# EAGLE design placa_motor_v5 (EAGLE 9.6.2)
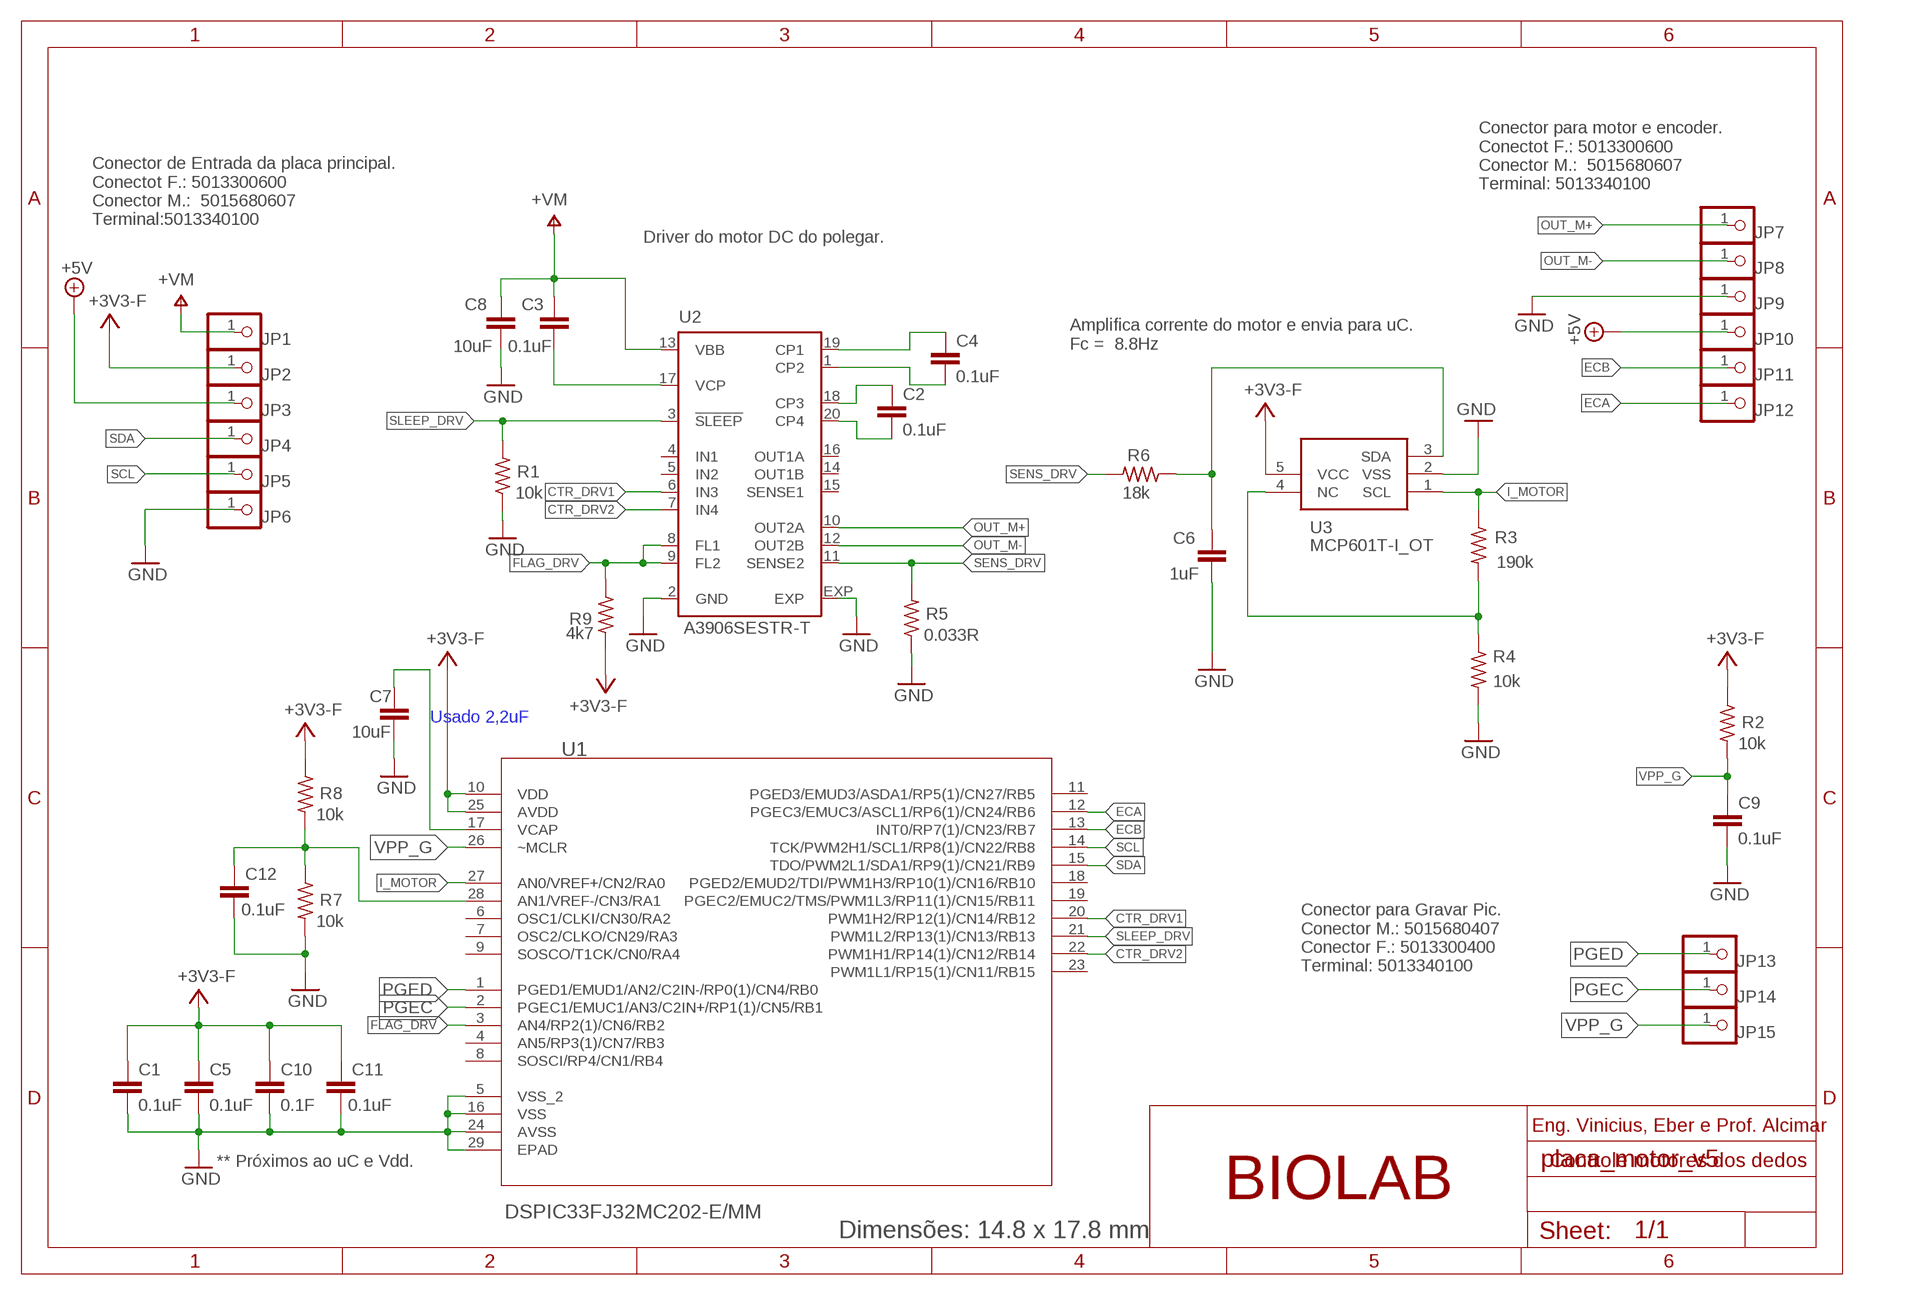
[diagram p0: schematic, sheet 1]

## Parts
C1  0.1uF  C-EUC0402K  [C0402K]
C2  0.1uF  C-EUC0402K  [C0402K]
C3  0.1uF  C-EUC0402K  [C0402K]
C4  0.1uF  C-EUC0402K  [C0402K]
C5  0.1uF  C-EUC0402K  [C0402K]
C6  1uF  C-EUC0402K  [C0402K]
C7  10uF  C-EUC0805K  [C0805K]
C8  10uF  C-EUC0805K  [C0805K]
C9  0.1uF  C-EUC0402K  [C0402K]
C10  0.1F  C-EUC0402K  [C0402K]
C11  0.1uF  C-EUC0402K  [C0402K]
C12  0.1uF  C-EUC0402K  [C0402K]
JP1  PINHD-1X1  [1X01]
JP2  PINHD-1X1  [1X01]
JP3  PINHD-1X1  [1X01]
JP4  PINHD-1X1  [1X01]
JP5  PINHD-1X1  [1X01]
JP6  PINHD-1X1  [1X01]
JP7  PINHD-1X1  [1X01]
JP8  PINHD-1X1  [1X01]
JP9  PINHD-1X1  [1X01]
JP10  PINHD-1X1  [1X01]
JP11  PINHD-1X1  [1X01]
JP12  PINHD-1X1  [1X01]
JP13  PINHD-1X1  [1X01]
JP14  PINHD-1X1  [1X01]
JP15  PINHD-1X1  [1X01]
R1  10k  R-US_R0402  [R0402]
R2  10k  R-US_R0402  [R0402]
R3  190k  R-US_R0402  [R0402]
R4  10k  R-US_R0402  [R0402]
R5  0.033R  R-US_R0805  [R0805]
R6  18k  R-US_R0402  [R0402]
R7  10k  R-US_R0402  [R0402]
R8  10k  R-US_R0402  [R0402]
R9  4k7  R-US_R0402  [R0402]
U1  DSPIC33FJ32MC202-E/MM  [QFN65P600X600X100-29N]
U2  A3906SESTR-T  A3906  [QFN20]
U3  MCP601T-I_OT  [SOT95P270X145-5N]

## Nets
+3V3: C1.1 C5.1 C10.1 C11.1 JP2.1 R2.1 R8.1 R9.2 U1.10(VDD) U1.25(AVDD) U3.5(VCC) ; supply symbol labelled +3V3-F
+5V: JP3.1 JP10.1
AUX: C12.1 R7.1 R8.2 U1.28(AN1/VREF-/CN3/RA1)
CTR_DRV1: U1.20(PWM1H2/RP12(1)/CN14/RB12) U2.6(IN3)
CTR_DRV2: U1.22(PWM1H1/RP14(1)/CN12/RB14) U2.7(IN4)
ECA: JP12.1 U1.12(PGEC3/EMUC3/ASCL1/RP6(1)/CN24/RB6)
ECB: JP11.1 U1.13(INT0/RP7(1)/CN23/RB7)
FLAG_DRV: R9.1 U1.3(AN4/RP2(1)/CN6/RB2) U2.8(FL1) U2.9(FL2)
GND: C1.2 C5.2 C6.2 C7.2 C8.1 C9.2 C10.2 C11.2 C12.2 JP6.1 JP9.1 R1.1 R4.2 R5.1 R7.2 U1.5(VSS_2) U1.16(VSS) U1.24(AVSS) U1.29(EPAD) U2.2(GND) U2.EXP U3.2(VSS)
I_MOTOR: R3.1 U1.27(AN0/VREF+/CN2/RA0) U3.1(SCL)
N1: C7.1 U1.17(VCAP)
N2: R3.2 R4.1 U3.4(NC)
N3: C6.1 R6.1 U3.3(SDA)
N4: C4.1 U2.19(CP1)
N5: C4.2 U2.1(CP2)
N6: C2.1 U2.18(CP3)
N7: C2.2 U2.20(CP4)
N8: C3.2 U2.17(VCP)
OUT_M+: JP7.1 U2.10(OUT2A)
OUT_M-: JP8.1 U2.12(OUT2B)
PGEC: JP14.1 U1.2(PGEC1/EMUC1/AN3/C2IN+/RP1(1)/CN5/RB1)
PGED: JP13.1 U1.1(PGED1/EMUD1/AN2/C2IN-/RP0(1)/CN4/RB0)
SCL: JP5.1 U1.14(TCK/PWM2H1/SCL1/RP8(1)/CN22/RB8)
SDA: JP4.1 U1.15(TDO/PWM2L1/SDA1/RP9(1)/CN21/RB9)
SENS_DRV: R5.2 R6.2 U2.11(SENSE2)
SLEEP_DRV: R1.2 U1.21(PWM1L2/RP13(1)/CN13/RB13) U2.3(!SLEEP)
V+: C3.1 C8.2 JP1.1 U2.13(VBB) ; supply symbol labelled +VM
VPP_G: C9.1 JP15.1 R2.2 U1.26(~MCLR)
Unconnected: U1.4(AN5/RP3(1)/CN7/RB3) U1.6(OSC1/CLKI/CN30/RA2) U1.7(OSC2/CLKO/CN29/RA3) U1.8(SOSCI/RP4/CN1/RB4) U1.9(SOSCO/T1CK/CN0/RA4) U1.11(PGED3/EMUD3/ASDA1/RP5(1)/CN27/RB5) U1.18(PGED2/EMUD2/TDI/PWM1H3/RP10(1)/CN16/RB10) U1.19(PGEC2/EMUC2/TMS/PWM1L3/RP11(1)/CN15/RB11) U1.23(PWM1L1/RP15(1)/CN11/RB15) U2.4(IN1) U2.5(IN2) U2.14(OUT1B) U2.15(SENSE1) U2.16(OUT1A)

## Notes on the sheet
- Conector para motor e encoder.
  Conectot F.: 5013300600
  Conector M.:  5015680607
  Terminal: 5013340100
- Conector de Entrada da placa principal.
  Conectot F.: 5013300600
  Conector M.:  5015680607
  Terminal:5013340100
- Driver do motor DC do polegar.
- Amplifica corrente do motor e envia para uC.
  Fc =  8.8Hz
- Usado 2,2uF
- Conector para Gravar Pic.
  Conector M.: 5015680407
  Conector F.: 5013300400
  Terminal: 5013340100
- Eng. Vinicius, Eber e Prof. Alcimar
- ** Próximos ao uC e Vdd. | Controle motores dos dedos
- BIOLAB
- Dimensões: 14.8 x 17.8 mm

## Library data of the parts
C1-C12 = rcl:C-EU: CAPACITOR, European symbol; SPICEPREFIX: C
JP1-JP15 = ABS_Lib:PINHD-1X1: PIN HEADER; CATEGORY: CONNECTOR; SUB-CATEGORY: PIN-HEADER
R1-R9 = rcl:R-US_: RESISTOR, American symbol; SPICEPREFIX: R
U1 = DSPIC33FJ32MC202-E_MM:DSPIC33FJ32MC202-E/MM: 16-bit Digital Signal Controllers; DESCRIPTION: dsPIC Automotive, AEC-Q100, dsPIC™ 33F Microcontroller IC 16-Bit 40 MIPs 32KB _32K x 8_ FLASH 28-QFN-S _6x6_; DIGI-KEY_PART_NUMBER: DSPIC33FJ32MC202-E/MM-ND; DIGI-KEY_PURCHASE_URL: https://www.digikey.com/product-detail/en/microchip-technology/DSPIC33FJ32MC202-E-MM/DSPIC33FJ32MC202-E-MM-ND/1635835?utm_source=snapeda&utm_medium=aggregator&utm_campaign=symbol; MF: Microchip; MP: DSPIC33FJ32MC202-E/MM; PACKAGE: QFN-28 Microchip
U2 = allegro:A3906: Low Voltage Stepper and Single/Dual DC Motor Driver Data Sheet <http://www.allegromicro.com/en/Products/Part_Numbers/3906/3906.pdf>; SPICEPREFIX: X
U3 = MCP601T-I_OT:MCP601T-I_OT: 2.7 to 5.5V CMOS Operational Amplifier Source: Datasheet <http://ww1.microchip.com/downloads/en/DeviceDoc/21178H.pdf>; DESCRIPTION: 2.7 to 5.5V CMOS Operational Amplifier; HEIGHT: 1.45mm; MANUFACTURER_NAME: Microchip; MANUFACTURER_PART_NUMBER: MCP601T-I/OT; MOUSER_PART_NUMBER: 579-MCP601T-I/OT; MOUSER_PRICE-STOCK: https://www.mouser.co.uk/ProductDetail/Microchip-Technology/MCP601T-I-OT?qs=TQnwojwsYvgI5ywjvKCAVw%3D%3D

## Net classes
0 default: width 0.09 mm, drill 0.254 mm, clearance 0.05 mm
1 Power: width 0.15 mm, drill 0.254 mm, clearance 0.05 mm to class 0, clearance 0.05 mm

## Board
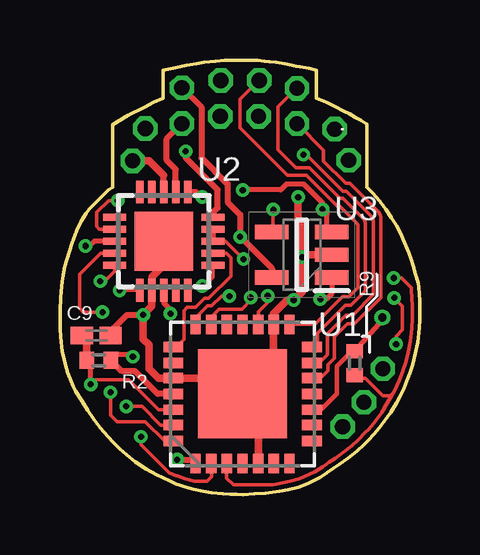
[diagram p1: board, top side]
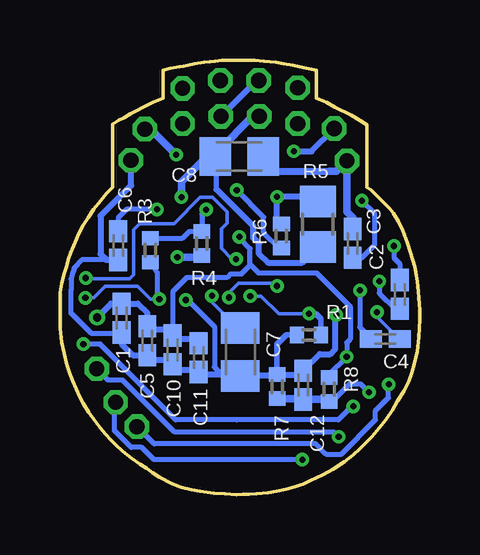
[diagram p2: board, bottom side, seen from below]

Size 15 x 18.11 mm. Coordinates in mm from the lower left corner, seen from the top.
Outline: 7.37,0 7.11,0.01 6.8,0.03 6.32,0.08 5.97,0.15 5.57,0.22 5.19,0.32 4.95,0.41 4.87,0.44 4.57,0.57 4.03,0.82 3.61,1.05 3.14,1.36 2.77,1.66 2.5,1.92 2.22,2.17 2,2.41 1.68,2.77 1.42,3.11 1.15,3.51 0.92,3.9 0.66,4.3 0.55,4.51 0.46,4.71 0.33,5.07 0.21,5.46 0.1,5.96 0.04,6.55 0.01,6.93 0,7.31 0,7.71 0.03,8.18 0.06,8.47 0.09,8.87 0.14,9.14 0.2,9.48 0.39,10.1 0.51,10.49 0.69,11 0.89,11.4 1.1,11.72 1.22,11.89 1.51,12.18 2.02,12.68 2.2,12.81 2.2,15.41 2.85,15.8 3.52,16.14 3.9,16.34 4.3,16.51 4.3,17.68 4.82,17.78 5.28,17.88 5.69,17.95 6,18.01 6.49,18.06 6.88,18.09 7.2,18.11 7.9,18.11 8.23,18.09 8.52,18.06 8.74,18.04 9,18.01 9.39,17.95 9.67,17.89 9.84,17.85 10.01,17.82 10.38,17.75 10.7,17.68 10.7,16.51 11.12,16.34 11.48,16.15 11.85,15.97 12.06,15.87 12.33,15.7 12.55,15.59 12.8,15.43 12.8,12.81 13.05,12.55 13.31,12.25 13.59,11.88 13.83,11.54 14.03,11.21 14.2,10.91 14.37,10.52 14.55,10.08 14.65,9.79 14.73,9.51 14.82,9.2 14.94,8.8 14.98,8.41 15,8.01 15,7.6 15,7.31 14.99,6.93 14.93,6.35 14.83,5.89 14.71,5.43 14.59,5.04 14.48,4.75 14.33,4.41 14.18,4.08 14.02,3.8 13.8,3.43 13.58,3.11 13.33,2.79 13.09,2.5 12.86,2.27 12.7,2.11 12.38,1.81 12.01,1.51 11.66,1.26 11.4,1.09 11.13,0.9 10.85,0.73 10.32,0.45 9.96,0.31 9.51,0.2 9.15,0.15 8.58,0.05 8.11,0.03 7.64,0 7.37,0
Copper layers (1*16): Top 0.035mm / dielectric 0.5mm / Bottom 0.035mm
Design rules "default *": minimum track width 6mil, minimum drill 6mil, track to track 6mil, track to pad 6mil, pad to pad 6mil, via to via 6mil, smd to smd 6mil, copper to edge 6mil, drill to drill 8mil, minimum pad ring 6mil, minimum via ring 6mil, stop-mask expansion 0mil, vias tented up to drill 0mil, thermal gap 10mil

### Footprints (pad centres in the part's own frame; a part is rotated, then mirrored left to right if it is on the bottom)
C0402K = smd 0.925 x 0.74: 1 -0.6,0; 2 0.6,0
C0805K = smd 1.3 x 1.6: 1 -1,0; 2 1,0
1X01 = drill 0.635 pad 1.016 octagon: 1 0,0
R0402 = smd 0.6 x 0.7: 1 -0.5,0; 2 0.5,0
R0805 = smd 1.3 x 1.5: 1 -0.95,0; 2 0.95,0
QFN65P600X600X100-29N = smd 0.813 x 0.432: 1 -2.896,1.956; 2 -2.896,1.295; 3 -2.896,0.66; 4 -2.896,0; 5 -2.896,-0.66; 6 -2.896,-1.295; 7 -2.896,-1.956; 15 2.896,-1.956; 16 2.896,-1.295; 17 2.896,-0.66; 18 2.896,0; 19 2.896,0.66; 20 2.896,1.295; 21 2.896,1.956 | smd 0.432 x 0.813: 8 -1.956,-2.896; 9 -1.295,-2.896; 10 -0.66,-2.896; 11 0,-2.896; 12 0.66,-2.896; 13 1.295,-2.896; 14 1.956,-2.896; 22 1.956,2.896; 23 1.295,2.896; 24 0.66,2.896; 25 0,2.896; 26 -0.66,2.896; 27 -1.295,2.896; 28 -1.956,2.896 | smd 3.708 x 3.708: 29 0,0
QFN20 = smd 0.95 x 0.3: 1 -2.05,1; 2 -2.05,0.5; 3 -2.05,0; 4 -2.05,-0.5; 5 -2.05,-1; 11 2.05,-1; 12 2.05,-0.5; 13 2.05,0; 14 2.05,0.5; 15 2.05,1 | smd 0.3 x 0.95: 6 -1,-2.05; 7 -0.5,-2.05; 8 0,-2.05; 9 0.5,-2.05; 10 1,-2.05; 16 1,2.05; 17 0.5,2.05; 18 0,2.05; 19 -0.5,2.05; 20 -1,2.05 | smd 2.45 x 2.45: EXP 0,0
SOT95P270X145-5N = smd 1.4 x 0.6: 1 -1.25,0.95; 2 -1.25,0; 3 -1.25,-0.95; 4 1.25,-0.95; 5 1.25,0.95

### Placement (x,y rotation side)
C1  12.43,7.35 270 bottom
C2  0.83,8.34 270 bottom
C3  2.79,10.47 270 bottom
C4  1.43,6.48 180 bottom
C5  11.36,6.41 270 bottom
C6  12.57,10.38 270 bottom
C7  7.47,5.94 270 bottom
C8  7.52,14.08 0 bottom
C9  1.52,6.63 0 top
C10  10.3,6.02 270 bottom
C11  9.22,5.71 270 bottom
C12  4.86,4.56 90 bottom
JP1  3.03,13.9 0 top
JP2  5.09,16.95 0 top
JP3  6.71,17.26 0 top
JP4  8.31,17.26 0 top
JP5  9.89,16.93 0 top
JP6  6.69,15.76 0 top
JP7  3.56,15.25 0 top
JP8  5.09,15.45 0 top
JP9  12.05,13.93 0 top
JP10  8.29,15.76 0 top
JP11  11.46,15.23 0 top
JP12  9.89,15.45 0 top
JP13  12.68,3.85 0 top
JP14  13.47,5.24 0 top
JP15  11.79,2.83 0 top
R1  4.62,6.65 0 bottom
R2  1.62,5.6 180 top
R3  11.23,10.18 90 bottom
R4  9.09,10.46 270 bottom
R5  4.24,11.26 90 bottom
R6  5.77,10.77 90 bottom
R7  5.94,4.49 90 bottom
R8  3.78,4.38 270 bottom
R9  12.29,5.47 90 top
U1  7.61,4.19 90 top
U2  4.33,10.56 90 top
U3  10.09,9.99 180 top

### Tracks (layer width: path | path; a pad name or v marks a point on that pad's centre or on a via)
+3V3  (via drill 0.25, 0.35)
  Top 0.178: U1.10 10.88,3.53 11.56,4.21 11.56,5.34 12.29,6.07 R9.2
  Top 0.203: 7.56,10.72 7.54,10.74 v7.52,10.74 | v13.45,7.37 13.45,7.28 R9.2 | JP2.1 | v3.04,5.74 2.97,5.82 2.33,5.82 R2.1
  Top 0.254: U1.25 4.08,4.19 3.13,5.14 2.58,5.14 R2.1 | U3.5 8.84,9.44 7.56,10.72 | JP2.1 5.9,16.15 5.9,14.03 6.99,12.93 6.99,12.18 7.52,11.66 v7.52,10.74
  Bottom 0.203: 7.06,9.57 6.73,9.24 4.3,9.24 2.89,7.83 2.89,6.48 3.04,6.33 v3.04,5.74 3.78,5.01 R8.1 | 7.06,9.57 7.07,9.58 7.07,10.25 7.52,10.69 v7.52,10.74 | 7.06,9.57 7.42,9.2 7.88,9.2 8.04,9.04 9.71,9.04 10.3,8.45 10.3,7.78 C10.1 | C11.1 9.41,6.5
  Bottom 0.254: v13.45,7.37 12.87,7.95 C1.1 11.76,7.96 11.36,7.56 11.36,7.1 | C5.1 11.36,7.1 | 11.36,7.1 11.12,6.87 10.52,6.87 10.3,6.65 C10.1 10.18,6.5 9.41,6.5
+5V
  Bottom 0.254: JP3.1 6.79,17.26 JP10.1
AUX  (via drill 0.25)
  Top 0.152: U1.28 4.35,2.24 3.55,3.04 2.39,3.04 2.11,3.32 v2.11,4.26
  Bottom 0.152: R8.2 3.7,3.83 | v2.11,4.26
  Bottom 0.203: 3.7,3.83 2.92,4.61 2.46,4.61 v2.11,4.26
  Bottom 0.305: R7.1 4.89,3.99 C12.1 3.78,3.96 R8.2
CTR_DRV1  (via drill 0.25)
  Top 0.152: U2.6 6.38,9.06 6.01,8.69 v5.95,8.69 | v7.95,8.21 7.95,8.09 7.6,7.73 6.63,7.73 6.32,7.42 U1.20
  Bottom 0.152: v7.95,8.21 7.95,8.42 7.56,8.81 6.07,8.81 v5.95,8.69
CTR_DRV2
  Top 0.152: U1.22 4.92,6.18 5.17,6.47 5.17,7.66 5.31,7.8 5.65,7.8 6.02,8.17 6.2,8.17 7.13,9.1 7.13,9.87 6.94,10.06 U2.7
ECA
  Top 0.152: U1.12 10.86,4.85 11.18,5.17 11.18,5.41 11.45,5.69 11.45,6.57 11.98,7.11 12.28,7.11 13.38,8.21 13.38,11.52 arc45 13.27,11.79 12.08,12.98 11.92,12.98 11,13.9 11,14.35 JP12.1
ECB  (via drill 0.25)
  Top 0.152: U1.13 10.81,5.49 11.15,5.82 11.15,6.7 11.92,7.48 12.21,7.48 13.08,8.35 13.08,11.34 arc45 12.95,11.64 11.94,12.65 11.8,12.65 10.29,14.16 v10.16,14.16
  Bottom 0.305: v10.16,14.16 11.22,15.23 JP11.1
FLAG_DRV  (via drill 0.25)
  Top 0.152: U2.8 6.91,10.56 v7.66,9.82 v7.66,9.81 | U1.3 6.95,0.69 7.23,0.41 8.88,0.41 9,0.43 9.59,0.55 10,0.67 10.63,0.96 10.96,1.16 11.12,1.27 11.22,1.34 | 13.93,4.27 14.06,4.54 14.16,4.77 14.29,5.14 14.3,5.15 14.42,5.52 14.53,5.96 14.62,6.39 14.66,6.72 14.69,6.95 14.7,7.31 14.7,7.55 14.69,7.54 14.69,7.87 14.66,8.51 14.65,8.62 14.25,9.03 v13.92,9.03 | 13.93,4.27 13.9,4.22 13.85,4.13 13.54,3.61 13.54,3.6 13.42,3.43 13.42,3.42 13.33,3.29 13.09,2.98 12.86,2.71 12.75,2.59 12.44,2.28 12.18,2.04 11.82,1.75 11.49,1.51 11.33,1.41 11.22,1.34 | R9.1 12.42,4.85 12.74,4.85 13.47,4.12 13.78,4.12 13.93,4.27 | 11.22,1.34
  Top 0.254: U2.8 U2.9
  Bottom 0.152: 13.89,8.99 12.1,8.99 11.94,9.15 11.94,11.03 11.67,11.29 10.25,11.29 9.15,12.39 8.65,12.39 8.03,11.78 8.03,11.31 8.26,11.08 8.26,10.25 7.86,9.85 7.69,9.85 v7.66,9.81
  Bottom 0.178: v13.92,9.03 13.89,8.99
GND  (via drill 0.25)
  Top 0.229: U2.2
  Top 0.254: 2.14,6.63 C9.2 2.12,6.8 2.8,7.48 v3.47,7.48 | v9.75,8.11 v9.76,8.11 | 6.95,4.85 7.53,4.27 | 7.53,4.27 U1.29 8.27,3.53 | 8.91,5.65 7.53,4.27
  Top 0.305: U1.16 | v9.94,12.39 9.94,11.51 10.1,11.34 v10.1,9.89 | v9.76,8.11 10.1,8.45 v10.1,9.89 | v9.75,8.11 9.74,8.1 9.47,8.1 8.91,7.54 U1.16 | 6.95,4.85 U1.24 4.11,4.85 3.72,5.25 3.72,6.24 3.47,6.48 v3.47,7.48 3.83,7.84 U2.2 | U1.16 8.91,5.65 | U1.5 8.27,3.53 | v10.1,9.89 10.21,9.99 U3.2 | U2.2 3.84,9.07 4.33,9.57 U2.EXP
  Bottom 0.152: 8.39,14.33 8.39,14.29 | 14.54,8.51 14.55,8.51
  Bottom 0.2: 14.09,9.78 14.4,9.46 14.42,9.41 14.45,9.28 14.46,9.28 14.48,9.19 14.54,8.99
  Bottom 0.203: C6.2 14.09,9.78 | 14.55,8.51 14.55,7.57 13.7,6.73 12.45,6.73 C1.2 | 14.54,8.99 14.54,8.51 | C7.2 7.57,5.03 8.29,5.03 8.56,5.31 8.56,7 9.67,8.11 v9.75,8.11 | 8.47,12.72 8.47,14.03
  Bottom 0.229: 8.3,14.08 C8.1 | R1.1 5.55,6.65 5.94,6.26 R7.2
  Bottom 0.254: 8.39,14.29 8.52,14.16 C8.1 8.47,14.03 | R4.2 9.09,9.89 | C6.2 13.06,9.78 13.3,10.02 13.3,11.61 12.03,12.89 12.03,13.92 JP9.1 | C1.2 12.43,6.27 11.97,5.81 C5.2 11.17,5.62 10.43,5.62 10.3,5.5 C10.2 10.09,5.21 9.32,5.21 C11.2 9.12,5.01 7.54,5.01 C7.2 7.44,4.97 5.96,4.97 R7.2 4.86,4.99 C12.2 4.17,5.85 3.73,5.85 3.52,6.06 3.52,7.44 v3.47,7.48 | 8.47,12.72 6.94,11.18 6.94,10.7 6.69,10.46 6.69,10.02 6.33,9.66 4.89,9.66 R5.1
  Bottom 0.305: 5.95,5.15 R7.2 5.93,5.13 | C8.1 8.89,14.08 9.94,13.04 v9.94,12.39 | JP6.1 6.96,15.76 8.39,14.33 | R4.2 9.16,9.89 v10.1,9.89 | C5.2
I_MOTOR  (via drill 0.25)
  Top 0.152: U1.27 4.19,2.9 3.42,3.67 v2.77,3.67 | v13.94,8.19 13.95,8.19 14.29,7.86 14.29,6.86 14.02,6.6 v14.02,6.27
  Top 0.203: U3.1 11.34,8.37 11.11,8.14 v10.86,8.14
  Bottom 0.152: 10.95,8.24 v10.86,8.14 11.22,8.14 11.76,8.69 13.11,8.69 13.6,8.19 v13.94,8.19 | 2.83,3.67 v2.77,3.67
  Bottom 0.2: 7.62,3.12 10.17,3.12 13.32,6.27 v14.02,6.27
  Bottom 0.203: R3.1 10.95,9.24 10.95,8.24 | 7.62,3.12 3.39,3.12 2.83,3.67
N1  (via drill 0.25)
  Top 0.152: U1.17 8.28,7.1 8.28,7.63 8.67,8.01 v8.67,8.28
  Bottom 0.152: C7.1 8.03,7.49 8.14,7.49 8.68,8.03 8.68,8.26 v8.67,8.28
N2  (via drill 0.25)
  Top 0.152: U3.4 8.89,10.89 8.89,11.86 v8.9,11.87
  Bottom 0.203: R3.2 9.89,10.68 9.61,10.96 R4.1 9.08,11.69 v8.9,11.87
N3  (via drill 0.25)
  Top 0.152: U3.3 11.14,10.94
  Top 0.203: v7.63,12.69 7.64,12.7 9.21,12.7 9.46,12.95 10.16,12.95 10.95,12.15 v10.95,11.89 11.14,11.69 11.14,10.94
  Bottom 0.203: C6.1 12.57,11.54 12.23,11.89 v10.95,11.89 | R6.1 5.87,10.27 6.5,10.91 6.5,11.56 v7.63,12.69
N4  (via drill 0.25)
  Top 0.152: U2.19 1.7,10.06 0.81,9.17 0.81,7.75 0.97,7.6 v1.78,7.6
  Bottom 0.152: v1.78,7.6 1.78,7.41 0.85,6.48 C4.1
N5  (via drill 0.25)
  Top 0.152: U2.1 v2.49,8.51
  Bottom 0.152: v2.49,8.51 v2.49,8.5
  Bottom 0.203: C4.2 2.03,6.51 2.49,6.98 v2.49,8.5
N6  (via drill 0.25)
  Top 0.203: U2.18 1.44,10.56 1.24,10.36 v1.07,10.36
  Bottom 0.203: v1.07,10.36 1.07,9.87 0.83,9.62 C2.1
N7  (via drill 0.25)
  Top 0.152: U2.20 2.28,9.31 1.86,8.89 v1.68,8.89
  Bottom 0.203: C2.2 1.02,7.74 1.68,8.39 v1.68,8.89
N8  (via drill 0.25)
  Top 0.152: v2.41,12.25 2.02,12.25 1.53,11.76 1.53,11.17 1.64,11.06 U2.17
  Bottom 0.203: C3.2 2.41,9.87 1.89,10.38 1.89,11.73 v2.41,12.25
OUT_M+  (via drill 0.25)
  Top 0.254: U2.10 6.38,11.75 6.58,11.95 6.58,12.7 5.25,14.03 v5.25,14.3
  Bottom 0.254: JP7.1 4.51,14.3 v5.25,14.3
OUT_M-
  Top 0.254: U2.12 4.83,13.55 4.45,13.93 4.45,14.82 JP8.1
PGEC  (via drill 0.25)
  Top 0.152: U1.2 6.32,0.74 6.13,0.55 5.61,0.55 5.22,0.65 4.88,0.78 4.84,0.78 4.69,0.85 4.54,0.92 3.38,2.08 v3.38,2.41
  Bottom 0.152: 12.98,4.77 12.99,4.77
  Bottom 0.2: 12.98,4.77 12.38,4.77 10.22,2.6 9.99,2.6
  Bottom 0.203: 9.99,2.6 3.57,2.6 v3.38,2.41 | 12.99,4.77 JP14.1
PGED  (via drill 0.25)
  Top 0.254: v4.89,1.46 5.5,1.46 U1.1
  Bottom 0.203: v4.89,1.45 11.08,1.45 11.59,1.96 12.03,1.96 12.72,2.66 12.72,3.8 JP13.1
  Bottom 0.254: v4.89,1.46 v4.89,1.45
SCL
  Top 0.152: U1.14 10.74,6.38 10.74,6.73 11.91,7.89 12.14,7.89 12.75,8.5 12.75,11.27 arc45 12.66,11.49 11.8,12.34 11.68,12.34 10.4,13.62 9.85,13.62 9.1,14.37 9.1,16.16 9.87,16.93 JP5.1
SDA
  Top 0.152: U1.15 10.63,7.09 11.78,8.24 12.05,8.24 12.42,8.61 12.42,11.21 arc45 12.38,11.31 11.65,12.04 11.54,12.04 10.28,13.3 9.49,13.3 7.5,15.29 7.5,16.47 8.29,17.26 JP4.1
SENS_DRV  (via drill 0.25)
  Top 0.254: U2.11 5.66,12.61 5.87,12.41 v5.94,12.41
  Bottom 0.254: R6.2 5.94,11.54 v5.94,12.41 4.44,12.41 R5.2
SLEEP_DRV  (via drill 0.25)
  Top 0.152: U1.21 5.66,7.37 6.15,7.87 6.33,7.87 6.73,8.27 v7.07,8.27 | U2.3
  Top 0.203: U2.3 4.33,7.98 4.61,7.7 v4.61,7.54
  Bottom 0.152: v7.07,8.27 6.62,8.27 5.88,7.52 4.62,7.52 v4.61,7.54
  Bottom 0.229: R1.2 4.12,7.33 4.32,7.54 v4.61,7.54
V+
  Top 0.254: U2.13 4.33,13.3
  Top 0.305: 4.33,13.3 3.73,13.9 JP1.1
  Bottom 0.3: 3.73,13.47 5.9,13.47 C8.2
  Bottom 0.305: C3.1 2.79,11.54 3.03,11.77 JP1.1 3.47,13.47 3.73,13.47
VPP_G  (via drill 0.25)
  Top 0.152: U1.26 4.27,3.53 4.12,3.53 2.86,4.79 1.48,4.79 v1.29,4.59
  Top 0.203: v1.29,4.59 1.29,5.38 1.12,5.55 R2.2
  Top 0.305: R2.2 1.12,6.43 C9.1
  Bottom 0.203: v1.29,4.59 1.3,4.58 1.3,4.03 1.84,3.49 1.84,3.11 3.26,1.69 3.9,1.69 4.32,2.11 11.07,2.11 JP15.1